# Altium schematic sheet LSWM_00_HCMS29_Lithium.SchDoc
size A4
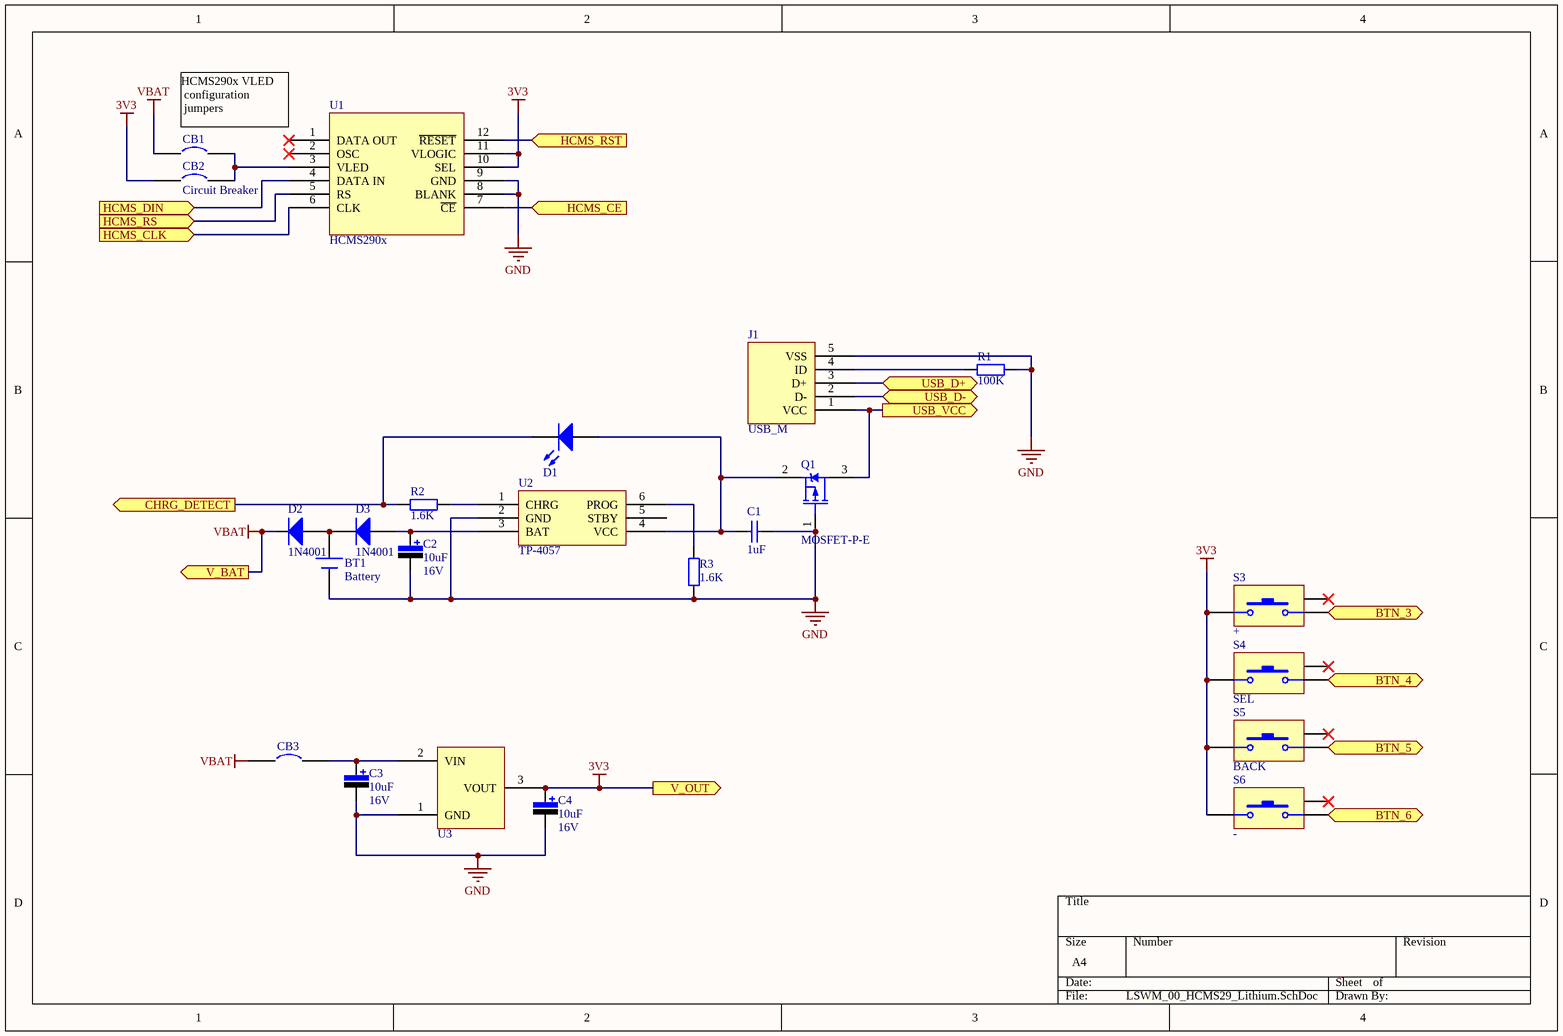
[diagram p0: LSWM_00_HCMS29_Lithium.SchDoc]

## Parts
BT1  Battery  [HDR2X1_A]
C1  value 1uF  [0805-1]  (hidden comment: Cap)
C2  value 10uF  Vol: 16V  [1206-POL]  (hidden comment: Cap Pol)
C3  value 10uF  Vol: 16V  [1206-POL]  (hidden comment: Cap Pol)
C4  value 10uF  Vol: 16V  [1206-POL]  (hidden comment: Cap Pol)
CB1  Circuit Breaker  [SB-0805]  (value not drawn)
CB2  Circuit Breaker  [SB-0805]
CB3  Circuit Breaker  [SB-0805]  (value not drawn)
D1  LED0  [LED_0805]  (value not drawn)
D2  Type: 1N4001  [SOD323]  (hidden comment: Diode)
D3  Type: 1N4001  [SOD323]  (hidden comment: Diode)
J1  USB_M  [USB_MICRO]
Q1  MOSFET-P-E  [SOT-23]
R1  value 100K  [0603-1]  (hidden comment: Res1)
R2  value 1.6K  [0603-1]  (hidden comment: Res1)
R3  value 1.6K  [0805-1]  (hidden comment: Res1)
S3  +  [BTN_2_4_35]
S4  SEL  [BTN_2_4_35]
S5  BACK  [BTN_2_4_35]
S6  -  [BTN_2_4_35]
U1  HCMS290x  [HCMS-290x]
U2  TP-4057  [SOT23-6]
U3  HT73xx  [SOT89N]  (value not drawn)

## Ports
BTN_3 (out), BTN_4 (out), BTN_5 (out), BTN_6 (out), CHRG_DETECT (out), HCMS_CE (in), HCMS_CLK (in), HCMS_DIN (in), HCMS_RS (in), HCMS_RST (in), USB_D+ (bidir), USB_D- (bidir), USB_VCC (out), V_BAT (out), V_OUT (out)

## Nets
3V3: C4.1 CB2.1 S3.1 S4.1 S5.1 S6.1 U1.10(SEL) U1.11(VLOGIC) U3.3(VOUT) ; port V_OUT
GND: BT1.2(-) C1.2 C2.2 C3.2 C4.2 J1.5(VSS) Q1.1(G) R1.2 R3.1 U1.8(BLANK) U1.9(GND) U2.2(GND) U3.1(GND)
VBAT: CB1.1 CB3.1 D2.2(K) ; port V_BAT
BTN_3: S3.2 ; port BTN_3
BTN_4: S4.2 ; port BTN_4
BTN_5: S5.2 ; port BTN_5
BTN_6: S6.2 ; port BTN_6
CHRG_DETECT: D1.2(K) R2.2 ; port CHRG_DETECT
HCMS_CE: U1.7(~{CE}) ; port HCMS_CE
HCMS_CLK: U1.6(CLK) ; port HCMS_CLK
HCMS_DIN: U1.4(DATA_IN) ; port HCMS_DIN
HCMS_RS: U1.5(RS) ; port HCMS_RS
HCMS_RST: U1.12(~{RESET}) ; port HCMS_RST
USB_D+: J1.3(D+) ; port USB_D+
USB_D-: J1.2(D-) ; port USB_D-
USB_VCC: J1.1(VCC) Q1.3(D) ; port USB_VCC
NetBT1_1: BT1.1(+) D2.1(A) D3.2(K)
NetC1_1: C1.1 D1.1(A) Q1.2(S) U2.4(VCC)
NetC2_1: C2.1 D3.1(A) U2.3(BAT)
NetC3_1: C3.1 CB3.2 U3.2(VIN)
NetCB1_2: CB1.2 CB2.2 U1.3(VLED)
NetJ1_4: J1.4(ID) R1.1
NetR2_1: R2.1 U2.1(CHRG)
NetR3_2: R3.2 U2.6(PROG)

Not connected (* = marked no-connect by the designer): S3 3*; S4 3*; S5 3*; S6 3*; U1 1(DATA_OUT)* 2(OSC)*; U2 5(STBY)

## Notes on the sheet
- HCMS290x VLED
  configuration
  jumpers

## Library data of the parts
BT1 = Battery_1: 备份电池; Published: 24-Mar-1999; LatestRevisionDate: 17-Jul-2002; LatestRevisionNote: Re-released for DXP Platform.; PackageReference: BAT-2; Publisher: Altium Limited
C1 = Cap: 无极性电容; Published: 8-Jun-2000; LatestRevisionDate: 17-Jul-2002; LatestRevisionNote: Re-released for DXP Platform.; PackageReference: RAD-0.3; Publisher: Altium Limited
C2-C4 = Cap Pol: 极性电解电容; Published: 8-Jun-2000; LatestRevisionDate: 17-Jul-2002; LatestRevisionNote: Re-released for DXP Platform.; PackageReference: RB7.6-15; Publisher: Altium Limited
D1 = LED0: 发光二极管; Published: 8-Jun-2000; LatestRevisionDate: 08-Jul-2005; LatestRevisionNote: Mech Layer 1 removed.; PackageReference: LED-0; Publisher: Altium Limited
D2 D3 = Diode: 二极管; Published: 8-Jun-2000; LatestRevisionDate: 17-Jul-2002; LatestRevisionNote: Re-released for DXP Platform.; PackageDocument: Sep-1996; PackageReference: SMC; Publisher: Altium Limited; Code_JEDEC: DO-214-AB
J1 = USB_M: MicroUSB接口
Q1 = MOSFET-P-E: P-Channel Enhanced MOSFET; PackageDocument: 1995/1996; Published: 8-Jun-2000; LatestRevisionDate: 17-Jul-2002; LatestRevisionNote: Re-released for DXP Platform.; PackageReference: E3; Publisher: Altium Limited
R1-R3 = Res1: 贴片电阻; Published: 8-Jun-2000; LatestRevisionDate: 17-Jul-2002; LatestRevisionNote: Re-released for DXP Platform.; PackageReference: AXIAL-0.4; Publisher: Altium Limited
S3-S6 = SW-PB: 微动开关; Published: 24-Mar-1999; LatestRevisionDate: 17-Jul-2002; LatestRevisionNote: Re-released for DXP Platform.; PackageReference: SPST-2; Publisher: Altium Limited
U1 = HCMS290x: HCMS LED display module
U2 = TP-4057: 500mA Linear Lithium Battery Charger
CB1-CB3 = Circuit Breaker: Published: 24-Mar-1999; LatestRevisionDate: 17-Jul-2002; LatestRevisionNote: Re-released for DXP Platform.; PackageReference: SPST-2; Publisher: Altium Limited; PackageDescription: Switch; 2 Leads
U3 = HT73xx: Output Voltage: *